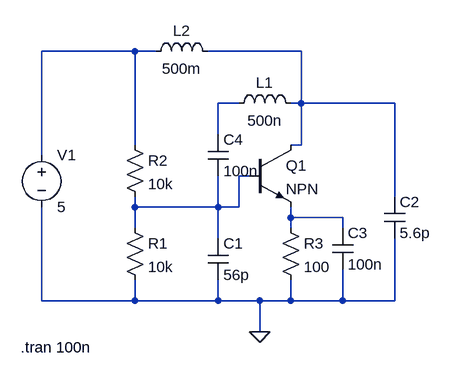
[diagram p0: schematic Colpitts.asc]
Colpitts.asc, the LTspice schematic file:
Version 4
SHEET 1 880 680
WIRE 80 -80 -64 -80
WIRE 112 -80 80 -80
WIRE 336 -80 192 -80
WIRE 240 0 208 0
WIRE 336 0 336 -80
WIRE 336 0 320 0
WIRE 480 0 336 0
WIRE 208 48 208 0
WIRE 80 64 80 -80
WIRE 336 64 336 0
WIRE 336 64 320 64
WIRE -64 80 -64 -80
WIRE 256 112 240 112
WIRE 480 144 480 0
WIRE 80 160 80 144
WIRE 208 160 208 112
WIRE 208 160 80 160
WIRE 240 160 240 112
WIRE 240 160 208 160
WIRE 320 176 320 160
WIRE 400 176 320 176
WIRE 80 192 80 160
WIRE 320 192 320 176
WIRE 400 192 400 176
WIRE 208 208 208 160
WIRE -64 304 -64 160
WIRE 80 304 80 272
WIRE 80 304 -64 304
WIRE 208 304 208 272
WIRE 208 304 80 304
WIRE 272 304 208 304
WIRE 320 304 320 272
WIRE 320 304 272 304
WIRE 400 304 400 256
WIRE 400 304 320 304
WIRE 480 304 480 208
WIRE 480 304 400 304
WIRE 272 352 272 304
FLAG 272 352 0
SYMBOL res 64 176 R0
SYMATTR InstName R1
SYMATTR Value 10k
SYMBOL res 64 48 R0
SYMATTR InstName R2
SYMATTR Value 10k
SYMBOL cap 192 208 R0
SYMATTR InstName C1
SYMATTR Value 56p
SYMBOL cap 464 144 R0
SYMATTR InstName C2
SYMATTR Value 5.6p
SYMBOL res 304 176 R0
SYMATTR InstName R3
SYMATTR Value 100
SYMBOL cap 384 192 R0
SYMATTR InstName C3
SYMATTR Value 100n
SYMBOL npn 256 64 R0
SYMATTR InstName Q1
SYMBOL cap 192 48 R0
SYMATTR InstName C4
SYMATTR Value 100n
SYMBOL ind 224 16 R270
WINDOW 0 32 56 VTop 2
WINDOW 3 5 56 VBottom 2
SYMATTR InstName L1
SYMATTR Value 500n
SYMBOL ind 96 -64 R270
WINDOW 0 32 56 VTop 2
WINDOW 3 5 56 VBottom 2
SYMATTR InstName L2
SYMATTR Value 500m
SYMBOL voltage -64 64 R0
WINDOW 123 0 0 Left 2
WINDOW 39 0 0 Left 2
SYMATTR InstName V1
SYMATTR Value 5
TEXT -96 376 Left 2 !.tran 100n

The netlist it stands for:
* Colpitts.asc
R1 N004 0 10k
R2 N001 N004 10k
C1 N004 0 56p
C2 N002 0 5.6p
R3 N005 0 100
C3 N005 0 100n
Q1 N002 N004 N005 0 NPN
C4 N003 N004 100n
L1 N003 N002 500n
L2 N001 N002 500m
V1 N001 0 5
.model NPN NPN
.model PNP PNP
.lib standard.bjt
.tran 100n
.backanno
.end